# Altium schematic sheet ADC.SchDoc
size A; SheetNumber: 11; SheetTotal: 25
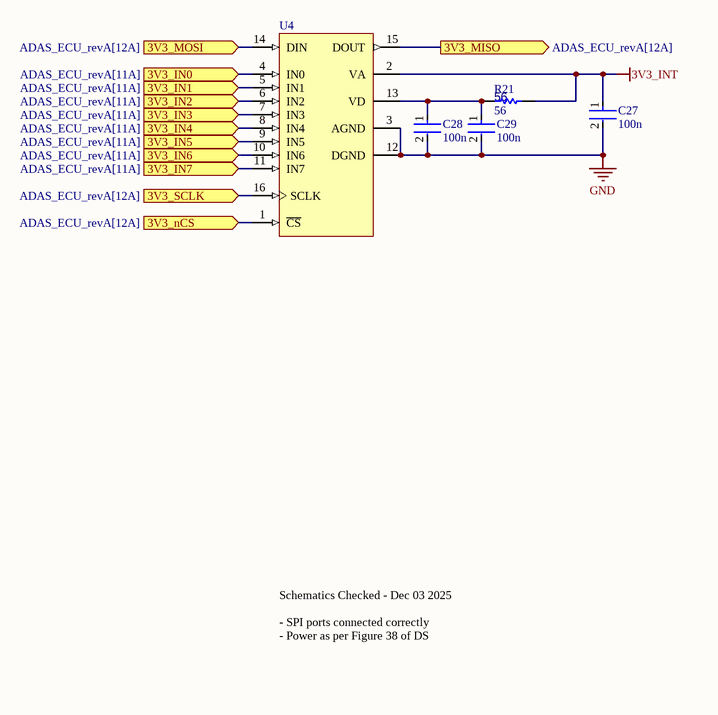
[diagram p0: ADC.SchDoc]

## Parts
C27  100n  [FP-0402-L_1_0_0_05-W_0_5-IPC_A]
C28  100n  [FP-0402-L_1_0_0_05-W_0_5-IPC_A]
C29  100n  [FP-0402-L_1_0_0_05-W_0_5-IPC_A]
R21  56  [R0603B]
U4  (no value)  [MTC16_L]

## Ports
3V3_IN0 (in, see ADAS_ECU_revA[11A]), 3V3_IN1 (in, see ADAS_ECU_revA[11A]), 3V3_IN2 (in, see ADAS_ECU_revA[11A]), 3V3_IN3 (in, see ADAS_ECU_revA[11A]), 3V3_IN4 (in, see ADAS_ECU_revA[11A]), 3V3_IN5 (in, see ADAS_ECU_revA[11A]), 3V3_IN6 (in, see ADAS_ECU_revA[11A]), 3V3_IN7 (in, see ADAS_ECU_revA[11A]), 3V3_MISO (out, see ADAS_ECU_revA[12A]), 3V3_MOSI (in, see ADAS_ECU_revA[12A]), 3V3_nCS (in, see ADAS_ECU_revA[12A]), 3V3_SCLK (in, see ADAS_ECU_revA[12A])

## Nets
3V3_INT: C27.1 R21.1 U4.2(VA)
GND: C27.2 C28.2 C29.2 U4.3(AGND) U4.12(DGND)
3V3_IN0: U4.4(IN0) ; port 3V3_IN0
3V3_IN1: U4.5(IN1) ; port 3V3_IN1
3V3_IN2: U4.6(IN2) ; port 3V3_IN2
3V3_IN3: U4.7(IN3) ; port 3V3_IN3
3V3_IN4: U4.8(IN4) ; port 3V3_IN4
3V3_IN5: U4.9(IN5) ; port 3V3_IN5
3V3_IN6: U4.10(IN6) ; port 3V3_IN6
3V3_IN7: U4.11(IN7) ; port 3V3_IN7
3V3_MISO: U4.15(DOUT) ; port 3V3_MISO
3V3_MOSI: U4.14(DIN) ; port 3V3_MOSI
3V3_nCS: U4.1(~{CS}) ; port 3V3_nCS
3V3_SCLK: U4.16(SCLK) ; port 3V3_SCLK
NetC28_1: C28.1 C29.1 R21.2 U4.13(VD)

## Notes on the sheet
- Schematics Checked - Dec 03 2025
  - SPI ports connected correctly
  - Power as per Figure 38 of DS

## Library data of the parts
C27-C29 = CMP-001-00058-1: LARGE PADS, 0402 CAP, CHANGE COMMENT TO MATCH REAL P/N; Capacitor Type: Ceramic; Min Operating Temperature: -55°C; Mounting Technology: Surface Mount; Pins: 2; Case/Package: 0402; RoHS Compliant: Yes; Max Operating Temperature: 85°C
R21 = CMP-009-00002-14: Resistor; Value: 56
U4 = CMP-0054-00372-2: 8-Channel, 50 kSPS to 200 kSPS, 8-Bit A/D Converter, 16-pin TSSOP, Pb-Free; Manufacturer: National Semiconductor; PackageTopMarking: NSUZXYTT*88S022*CIMT; CompType: ADC IC; PowerWise: Y; ComponentLink2URL: http://www.national.com/pf/AD/ADC088S022.html; RoHS: Y; PackageDescription: Molded TSSOP, Jedec, 5 x 4.4 x 0.9mm Body, 16 Lead, 0.65mm Pitch; DatasheetVersion: Feb-2010; PinCount: 16; ComponentLink1Description: ADC088S022 Datasheet; Code_JEDEC: MO-153-AB; ComponentLink3URL: http://www.national.com/packaging/folders/mtc16.html; PackageVersion: revD, Jun-2003; ComponentLink3Description: MTC16 Package Page; RevisionNote: Component URLs added; ComponentLink1URL: http://www.national.com/ds/AD/ADC088S022.pdf; ComponentLink2Description: ADC088S022 Web Page; PackageReference: MTC16